# EasyEDA Pro project 原理图.epro

# Schematic 原理图
Board Name: Board1; Create Date: 2026-07-09; Page Name: P1; Project Name: H750VBT6_网球回收机器人; Schematic Name: 原理图; Update Date: 2026-07-12; Company: 嘉立创EDA; Page Size: A4; Version: V1.0
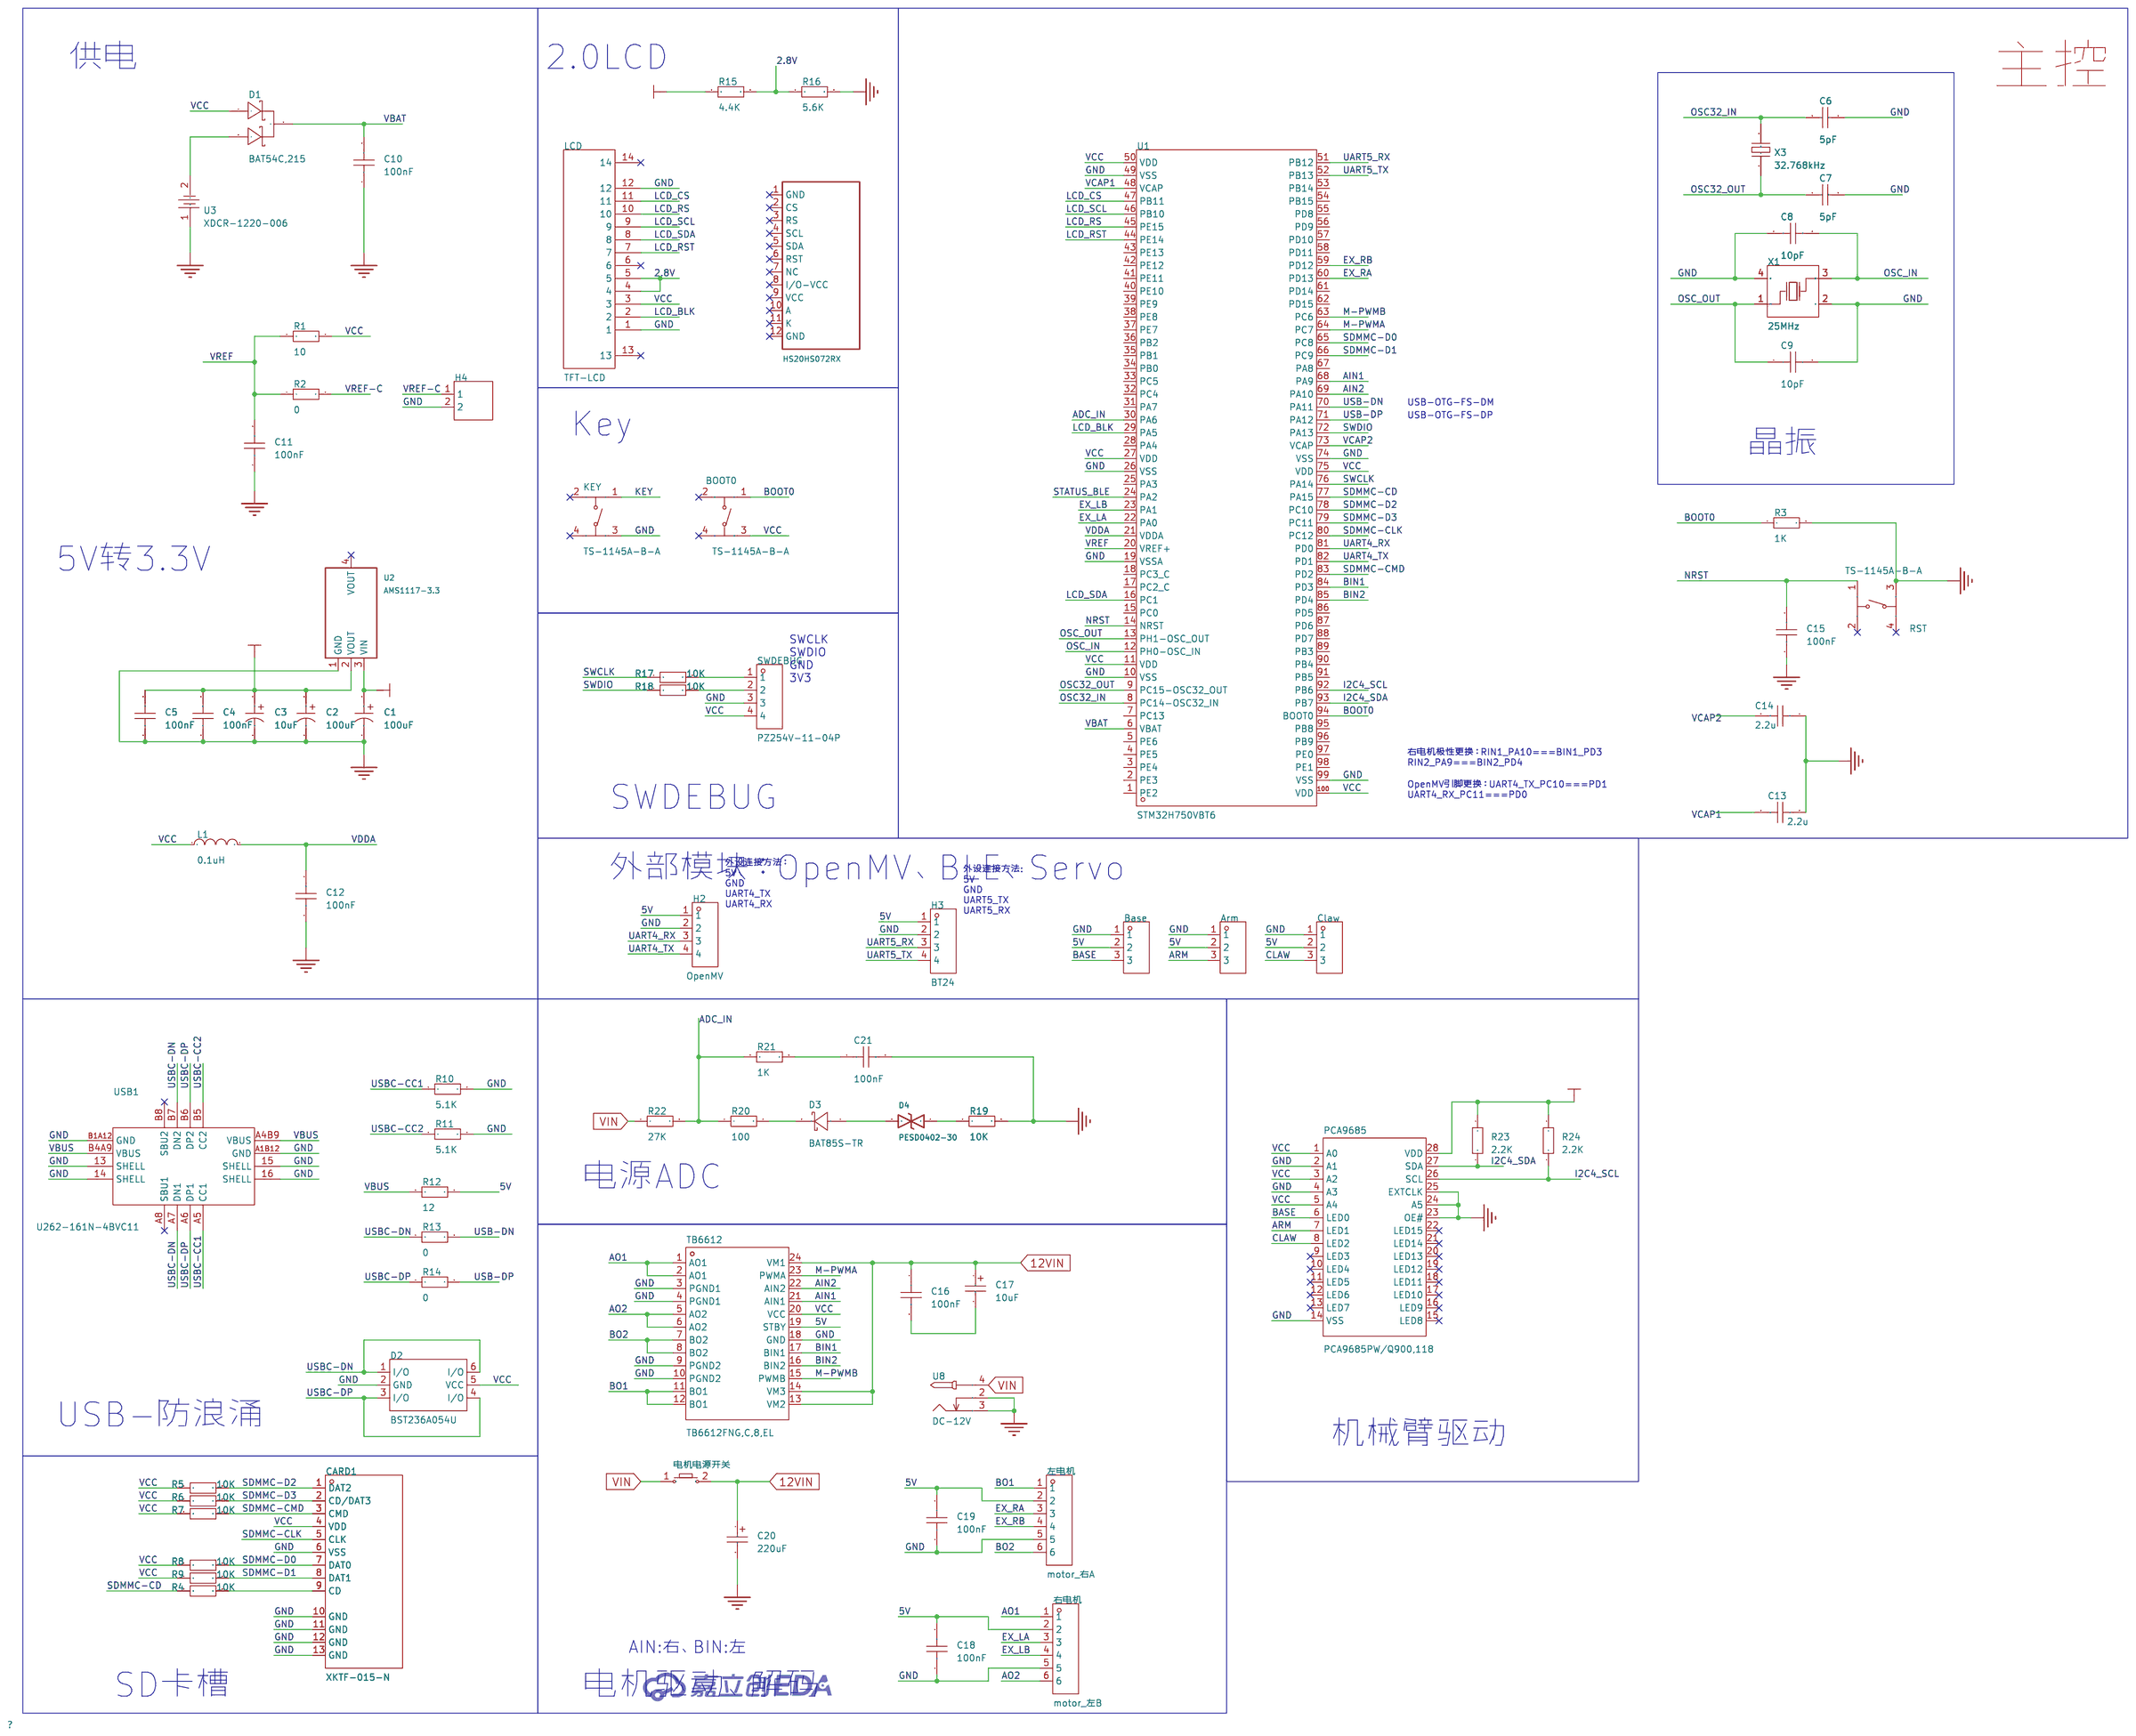
[diagram p0: schematic sheet]

## Parts
Arm  -  [HDR-TH_3P-P2.54-V-M]
Base  -  [HDR-TH_3P-P2.54-V-M]
BOOT0  TS-1145A-B-A  [SW-SMD_4P-L4.2-W3.2-P2.15-LS5.2]
C1  100uF  [CAP-SMD_L3.5-W2.8-FD]
C2  100uF  [CAP-SMD_L3.5-W2.8-FD]
C3  10uF  [CAP-SMD_L3.5-W2.8-FD]
C4  100nF  [C0603]
C5  100nF  [C0603]
C6  5pF  [C0402]
C7  5pF  [C0402]
C8  10pF  [C0402]
C9  10pF  [C0402]
C10  100nF  [C0402]
C11  100nF  [C0402]
C12  100nF  [C0402]
C13  2.2u  [C0402]
C14  2.2u  [C0402]
C15  100nF  [C0402]
C16  100nF  [C0402]
C17  10uF  [C_Ele_SMD_3x5.4mm]
C18  100nF  [C0402]
C19  100nF  [C0402]
C20  220uF  [C_Ele_SMD_3x5.4mm]
C21  100nF  [C0603]
CARD1  XKTF-015-N  [TF-SMD_XKTF-015-N]
Claw  -  [HDR-TH_3P-P2.54-V-M]
D1  BAT54C,215  [SOT-23-3_L2.9-W1.6-P1.90-LS2.8-BR]
D2  BST236A054U  [SOT-23-6_L2.9-W1.6-P0.95-LS2.8-BR]
D3  BAT85S-TR  [DO-35_BD1.7-L3.8-P7.8-D0.5-FD]
D4  PESD0402-30  [D0402-BI]
H2  OpenMV  [HDR-TH_4P-P2.54-V-M]
H3  BT24  [HDR-TH_4P-P2.54-V-M]
H4  -  [HDR-TH_2P-P2.54-V-M-1]
KEY  TS-1145A-B-A  [SW-SMD_4P-L4.2-W3.2-P2.15-LS5.2]
L1  0.1uH  [L0805]
LCD  TFT-LCD  [FPC-SMD_AFC01-S12FCA-00]
PCA9685  PCA9685PW/Q900,118  [TSSOP-28_L9.7-W4.4-P0.65-LS6.4-BL]
R1  10  [R0402]
R2  0  [R0402]
R3  1K  [R0402]
R4  10K  [R0402]
R5  10K  [R0402]
R6  10K  [R0402]
R7  10K  [R0402]
R8  10K  [R0402]
R9  10K  [R0402]
R10  5.1K  [R0402]
R11  5.1K  [R0402]
R12  12  [R0402]
R13  0  [R0402]
R14  0  [R0402]
R15  4.4K  [R0402]
R16  5.6K  [R0402]
R17  10K  [R0402]
R18  10K  [R0402]
R19  10K  [R0603]
R20  100  [R0603]
R21  1K  [R0603]
R22  27K  [R0603]
R23  2.2K  [R0603]
R24  2.2K  [R0603]
RST  TS-1145A-B-A  [SW-SMD_4P-L4.2-W3.2-P2.15-LS5.2]
SWDEBUG  PZ254V-11-04P  [HDR-TH_4P-P2.54-V-M]
TB6612  TB6612FNG,C,8,EL  [SSOP-24_L8.3-W5.6-P0.65-LS7.6-BL]
U1  STM32H750VBT6  [LQFP-100_L14.0-W14.0-P0.50-LS16.0-BL]
U2  AMS1117-3.3  [SOT-223-3_L6.5-W3.4-P2.30-LS7.0-BR]
U3  XDCR-1220-006  [BAT-SMD_CR1220-2ZX]
U7  HS20HS072RX  [OLED-SMD_HS20HS072RX]
U8  DC-12V  [DC-IN-TH_DC005-2.5MM]
USB1  U262-161N-4BVC11  [USB-3.1-SMD_U262-161N-4BVC11]
X1  25MHz  [CRYSTAL-SMD_4P-L3.2-W2.5-BL]
X3  32.768kHz  [CRYSTAL-SMD_L3.2-W1.5-1]
右电机  motor_左B  [CONN-TH_6P-P2.50_ZX-XH2.54-6PZZ]
左电机  motor_右A  [CONN-TH_6P-P2.50_ZX-XH2.54-6PZZ]
电机电源开关  -  [Key_SMD_3x4x2]

## Library data of the parts
Arm Base Claw = HDR-M_2.54_1x3P: Supplier Part: C2937625; Supplier Footprint: 插件
BOOT0 KEY RST = TS-1145A-B-A: 电路结构:单刀单掷;按钮形状:椭圆形按钮;作用力:160gf;安装方式:立贴;开关长度:4.2mm;开关宽度:3.2mm;开关高度:2.5mm;带支架:不带;触点电流:50mA;额定电压(DC):12V;绝缘电阻:-;带灯:无;机械寿命:10万次;; LCSC Part Name: 4.2*3.2*2.5mm 立贴 轻触开关; Supplier Part: C318904; Manufacturer: XKB Connectivity(中国星坤); Supplier Footprint: SMD; JLCPCB Part Class: 扩展库; Datasheet: https://atta.szlcsc.com/upload/public/pdf/source/20211011/FC00869C3CE33BCCD344D072F551E76B.pdf; Supplier: LCSC; Circuit: 单刀单掷; Actuator Style: 椭圆形按钮; Operating Force: 160gf; Mounting Style: 立贴; Switch Length: 4.2mm; Switch Width: 3.2mm; Switch Height: 2.5mm; Strike Gundam: 不带; Contact Current: 50mA; Voltage Rating (DC): 12V; Actuator/Cap Color: 白色; With Lamp: 无; Mechanical Life: 10万次; Operating Temperature: -30℃~+85℃
C1-C3 = CA45-B-10V-10UF-K: 容值:10uF;精度:±10%;额定电压:10V;等效串联电阻:-;; LCSC Part Name: 10uF ±10% 10V; Supplier Part: C2841149; Manufacturer: CEC(振华新云); Supplier Footprint: CASE-B-3528; JLCPCB Part Class: 扩展库; Datasheet: https://atta.szlcsc.com/upload/public/pdf/source/20210624/C2841149_442041CAD7FE484F90FD4ADE9C9027DE.pdf; Supplier: LCSC; Tolerance: ±10%; Rated Voltage: 10V
C4 C5 C21 = CAP_0603: Supplier Footprint: 0603
C6 C7 = 0402CG5R0C500NT: 容值:5pF;额定电压:50V;温度系数:C0G;; LCSC Part Name: ±0.25pF 5pF 50V; Supplier Part: C1573; Manufacturer: FH(风华); Supplier Footprint: 0402; JLCPCB Part Class: 扩展库; Datasheet: https://item.szlcsc.com/datasheet/0402CG5R0C500NT/1925.html; Supplier: LCSC; Voltage Rating: 50V; Temperature Coefficient: C0G
C8 C9 = CL05C100JB5NNNC: 容值:10pF;精度:±5%;额定电压:50V;温度系数:C0G;; LCSC Part Name: 10pF ±5% 50V; Supplier Part: C32949; Manufacturer: SAMSUNG(三星); Supplier Footprint: 0402; JLCPCB Part Class: 基础库; Datasheet: https://item.szlcsc.com/datasheet/CL05C100JB5NNNC/33914.html; Supplier: LCSC; Tolerance: ±5%; Voltage Rating: 50V; Temperature Coefficient: C0G
C10-C16 C18 C19 = CAP_0402: Supplier Footprint: 0402
C17 C20 = C_Ele_SMD_3x5.4mm: Supplier Footprint: SMD,3x5.4mm
CARD1 = XKTF-015-N: 卡连接方式:自弹式;卡类型:MicroSD卡(TF卡);连接器类型:卡座;本体最大高度:2mm;工作温度:-25℃~+90℃;; LCSC Part Name: 自弹式 MicroSD卡(TF卡) 卡座; Supplier Part: C381082; Manufacturer: XKB Connection(中国星坤); Supplier Footprint: SMD; JLCPCB Part Class: 扩展库; Datasheet: https://item.szlcsc.com/datasheet/XKTF-015-N/353314.html; Supplier: LCSC; Card Connection Mode: 自弹式; Card Type: MicroSD卡(TF卡); Connector Type: 卡座; Height Above Board: 2mm; Operating Temperature: -25℃~+90℃
D1 = BAT54C,215: 二极管配置:1对共阴极;正向压降(Vf):800mV@100mA;直流反向耐压(Vr):30V;整流电流:200mA;; LCSC Part Name: 电压:30V 电流:200mA; Supplier Part: C37704; Manufacturer: Nexperia(安世); Supplier Footprint: SOT-23; JLCPCB Part Class: 扩展库; Datasheet: https://item.szlcsc.com/datasheet/BAT54C%252C215/38684.html; Supplier: LCSC; Diode Configuration: 1对共阴极; Voltage - Forward(Vf@If): 800mV@100mA; Voltage - DC Reverse(Vr): 30V; Current - Rectified: 200mA; Reverse Leakage Current (Ir): 2uA@25V; Non-Repetitive Peak Forward Surge Current: 600mA
D2 = BST236A054U: 极性:-;反向截止电压(Vrwm):5V;钳位电压:13V;峰值脉冲电流(Ipp):3.5A;峰值脉冲功率(Ppp):45W@8/20us;击穿电压:6V;; LCSC Part Name: ESD 5V截止 峰值浪涌电流：3.5A; Supplier Part: C406203; Manufacturer: BORN(伯恩半导体); Supplier Footprint: SOT-23-6; JLCPCB Part Class: 扩展库; Datasheet: https://item.szlcsc.com/datasheet/BST236A054U/393966.html; Supplier: LCSC; Reverse Stand-Off Voltage (Vrwm): 5V; Clamping Voltage: 13V; Peak Pulse Current (Ipp): 3.5A; Peak Pulse Power Dissipation (Ppp): 45W@8/20us; Voltage - Breakdown: 6V; Reverse Leakage Current (Ir): 500nA; Number of Channels: 四路; level of protection: IEC 61000-4-4；IEC 61000-4-5；IEC 61000-4-2; Type: ESD; Junction Capacitance: 0.2pF；0.36pF
D3 = BAT85S-TR: 二极管配置:1个独立式;正向压降(Vf):800mV@100mA;直流反向耐压(Vr):30V;整流电流:200mA;; Supplier Part: C5334431; Manufacturer: VISHAY(威世); Supplier Footprint: DO-35; JLCPCB Part Class: 扩展库; Datasheet: https://item.szlcsc.com/datasheet/BAT85S-TR/6098608.html; Supplier: LCSC; Diode Configuration: 1个独立式; Voltage - Forward(Vf@If): 800mV@100mA; Voltage - DC Reverse(Vr): 30V; Current - Rectified: 200mA; Reverse Leakage Current (Ir): 2uA@25V; Non-Repetitive Peak Forward Surge Current: 5A
D4 = PESD0402-30: 极性:双向;反向截止电压(Vrwm):30V;钳位电压:40V;; Supplier Part: C55111460; Manufacturer: R+O(宏嘉诚); Supplier Footprint: 0402; JLCPCB Part Class: 扩展库; Datasheet: https://item.szlcsc.com/datasheet/PESD0402-30/58798226.html; Supplier: LCSC; Polarity: 双向; Reverse Stand-Off Voltage (Vrwm): 30V; Clamping Voltage: 40V; Reverse Leakage Current (Ir): 10nA; Number of Channels: 单路; Operating Temperature: -55℃~+125℃; level of protection: IEC 61000-4-2; Type: ESD; Junction Capacitance: 0.05pF
H2 H3 SWDEBUG = PZ254V-11-04P: 插针结构:1x4P;间距:2.54mm;行距:-;圆针/方针:方针;安装方式:直插;排数:单排;总PIN位数:4P;额定电流:3A;额定电压:250V;配合针长度:6mm;塑高:2.5mm;端接针长度:3mm;触头材质:-;工作温度:-40℃~+105℃;颜色:黑色;; LCSC Part Name: 1x4P 间距:2.54mm 方针 直插; Supplier Part: C2691448; Manufacturer: XFCN(兴飞); Supplier Footprint: 插件,P=2.54mm; JLCPCB Part Class: 扩展库; Datasheet: https://item.szlcsc.com/datasheet/PZ254V-11-04P/2801085.html; Supplier: LCSC; Pin Structure: 1x4P; Pitch: 2.54mm; Circluar Pins/Square Pins: 方针; Mounting Type: 直插; Number of Rows: 单排; Number of Pins: 4P; Current Rating: 3A; Voltage Rating (Max): 250V; Length of Mating Pin: 6mm; Insulation Height: 2.5mm; Length of End Connection Pin: 3mm; Operating Temperature: -40℃~+105℃; Color: 黑色
H4 = HDR-M_2.54_1x2P: Supplier Part: C124375; Supplier Footprint: 插件
L1 = L_0805
LCD = AFC01-S12FCA-00: 锁定特性:翻盖式;触点类型:下接;触点数量:12P;间距:0.5mm;安装方式:卧贴;; LCSC Part Name: 间距:0.5mm P数:12P 翻盖式 下接; Supplier Part: C262661; Manufacturer: JS(钜硕电子); Supplier Footprint: SMD,P=0.5mm,卧贴; JLCPCB Part Class: 扩展库; Datasheet: https://item.szlcsc.com/datasheet/AFC01-S12FCA-00/253920.html; Supplier: LCSC; Locking Feature: 翻盖式; Contact Type: 下接; Number of Contacts: 12P; Pitch: 0.5mm; Mounting Type: 卧贴; FFC, FCB Thickness: 0.3mm; Height Above Board: 2mm
PCA9685 = PCA9685PW/Q900,118: 类型:-;工作电压(DC):2.3V~5.5V;通道数:16;输出电压:5.5V;输出电流:25mA;调光:PWM;; Supplier Part: C92206; Manufacturer: NXP(恩智浦); Supplier Footprint: TSSOP-28; JLCPCB Part Class: 扩展库; Datasheet: https://www.nxp.com.cn/docs/en/data-sheet/PCA9685.pdf; Supplier: LCSC; Voltage - Input(DC): 2.3V~5.5V; Number of Channels: 16; Output Voltage: 5.5V; Output Current: 25mA; Dimming: PWM; Operating temperature: -40℃~+85℃
R1-R18 = Res_0402: Supplier Footprint: 0402
R19-R24 = Res_0603: Supplier Footprint: 0603
TB6612 = TB6612FNG,C,8,EL: TB6612FNG 是一款直流电机驱动 IC，其输出晶体管采用低导通电阻的 LD MOS 结构。两个输入信号 IN1 和 IN2 可选择四种模式之一，如正转、反转、短路制动和停止模式。; LCSC Part Name: 1A 有刷直流电机驱动芯片 5.5V; Supplier Part: C141517; Manufacturer: TOSHIBA(东芝); Supplier Footprint: SSOP-24; JLCPCB Part Class: 扩展库; Datasheet: https://item.szlcsc.com/datasheet/TB6612FNG%252CC%252C8%252CEL/152848.html; Supplier: LCSC; Technology: 是; Number of H-bridges: 2; Output Current: 1A; Peak Current: 3.2A; Voltage - Supply: 2.7V~5.5V; RDS(on): 500mΩ; Quiescent Current(Iq): 1uA; Operating Temperature: -20℃~+85℃
U1 = STM32H750VBT6: CPU内核:ARM-M系列;CPU最大主频:480MHz;应用领域:-;; LCSC Part Name: 带DSP和DP-FPU的高性能ARM Cortex-M7 MCU，具有128 KB Flash、1 MB RAM、480 MHz CPU、一级缓存、外部存储器接口、JPEG编解码器、硬件加密和大量外设; Supplier Part: C404010; Manufacturer: ST(意法半导体); Supplier Footprint: LQFP-100(14x14); JLCPCB Part Class: 扩展库; Datasheet: https://item.szlcsc.com/datasheet/STM32H750VBT6/391001.html; Supplier: LCSC; CPU Core: ARM-M系列; CPU Maximum Speed: 480MHz; Program Storage Size: 128KB; Program Memory Type: FLASH; Number of I/O: 82; ADC (Bit): 16bit; DAC (Bit): 12bit; Voltage - Supply: 1.62V~3.6V
U2 = AMS1117-3.3_C6186: 输出极性:正极;工作电压:15V;输出电压:3.3V;输出电流:1A;电源纹波抑制比(PSRR):72dB@(120Hz);输出类型:固定;; LCSC Part Name: 3.3V 1A 15V; Supplier Part: C6186; Manufacturer: Advanced Monolithic Systems; Supplier Footprint: SOT-223; JLCPCB Part Class: 基础库; Datasheet: https://item.szlcsc.com/datasheet/AMS1117-3.3/6652.html; Supplier: LCSC; Output Configuration: 正极; Voltage - Supply: 15V; Output Voltage: 3.3V; Output Current: 1A; Power Supply Rejection Ratio (PSRR): 72dB@(120Hz); Voltage Dropout: 1.1V@(800mA); standby current: 5mA; Noise: 0.003%Vout; Features: 短路保护；热关断；过流保护; Operating Temperature: -40℃~+125℃; Output Type: 固定; Number of Outputs: 1
U3 = XDCR-1220-006: 连接器类型:电池底座;适用电池规格:CR1220;触头材质:-;触头镀层:金;工作温度:-40℃~+85℃;; LCSC Part Name: 电池底座 适用电池:CR1220; Supplier Part: C7498147; Manufacturer: LX(连欣科技); Supplier Footprint: SMD; JLCPCB Part Class: 扩展库; Datasheet: https://item.szlcsc.com/datasheet/XDCR-1220-006/8568589.html; Supplier: LCSC; Connector Type: 电池底座; Battery Type: CR1220; Contact Plating: 金; Operating Temperature: -40℃~+85℃
U7 = HS20HS072RX: 核心芯片:ST7789;接口类型:SPI;尺寸(inch):2;像素分辨率:320x240;; LCSC Part Name: 2.0寸240*320(RGB)彩色SPI串口TFT液晶显示屏; Supplier Part: C5329582; Manufacturer: HS(汉昇); JLCPCB Part Class: 扩展库; Datasheet: https://item.szlcsc.com/datasheet/HS20HS072RX/6087843.html; Supplier: LCSC; Controller Type: ST7789; Interface: SPI; Size: 2; Dot Pixels: 320x240; Operating Temperature: -20℃~+70℃; Display Range: 30.6x40.8mm; Viewing Direction: 全视角; Voltage - Supply: 2.4V~3.3V；1.65V~3.3V
U8 = DC005-2.5: 连接器类型:DC电源插座;安装方式:弯插;触点内径:2.5mm;触点外径:6.3mm;额定电流:500mA;额定电压:12V;工作温度:-30℃~+70℃;; LCSC Part Name: DC005-2.5黑(铁); Supplier Part: C7507454; Manufacturer: SHOU HAN(首韩); Supplier Footprint: 插件; JLCPCB Part Class: 扩展库; Datasheet: https://item.szlcsc.com/datasheet/DC005-2.5/8598476.html; Supplier: LCSC; Connector Type: DC电源插座; Mounting Type: 弯插; Inside Contact Diameter: 2.5mm; Outside Contact Diameter: 6.3mm; Current Rating: 500mA; Voltage Rating (Max): 12V; Operating Temperature: -30℃~+70℃
USB1 = U262-161N-4BVC11: 连接器类型:Type-C;协议标准:-;公母:母;安装方式:卧贴;触点数量:16P;端口数量:1;额定电流 - 电源:3A;工作温度:-40℃~+85℃;; LCSC Part Name: Type-C 母 卧贴; Supplier Part: C319148; Manufacturer: XKB Connection(中国星坤); Supplier Footprint: SMD; JLCPCB Part Class: 扩展库; Datasheet: https://item.szlcsc.com/datasheet/U262-161N-4BVC11/300240.html; Supplier: LCSC; Connector Type: Type-C; Gender: 母; Mounting Type: 卧贴; Number of Contacts: 16P; Number of Ports: 1; Current Rating-Power: 3A; Connect-Disconnect Life: 3千次; Length: 7.3mm; Operating Temperature: -40℃~+85℃
X1 = X322525MOB4SI: 晶振类型:贴片晶振;频率:25MHz;常温频差:±10ppm;负载电容:12pF;频率稳定度:±20ppm;; LCSC Part Name: YSX321SL 25MHZ 4P 3225 12PF ±10PPM -40~85℃ (±20PPM); Supplier Part: C9006; Manufacturer: YXC(扬兴晶振); Supplier Footprint: SMD3225-4P; JLCPCB Part Class: 基础库; Datasheet: https://item.szlcsc.com/datasheet/X322525MOB4SI/9526.html; Supplier: LCSC; Type: 贴片晶振; Normal temperature Frequency Tolerance: ±10ppm; Load Capacitance: 12pF; Frequency Stability: ±20ppm; Operating Temperature: -40℃~+85℃
X3 = FC-135R 32.7680KA-A3: 频率:32.768kHz;常温频差:±20ppm;负载电容:12.5pF;; LCSC Part Name: 32.768kHz ±20ppm 12.5pF; Supplier Part: C6554955; Manufacturer: EPSON(爱普生); Supplier Footprint: SMD3215-2P; JLCPCB Part Class: 扩展库; Datasheet: https://item.szlcsc.com/datasheet/FC-135R%252032.7680KA-A3/7508731.html; Supplier: LCSC; Normal temperature Frequency Tolerance: ±20ppm; Load Capacitance: 12.5pF; Equivalent Series Resistance(ESR): 50kΩ; Operating Temperature: -40℃~+85℃
右电机 左电机 = ZX-XH2.54-6PZZ: 插针结构:1x6P;间距:2.5mm;安装方式:直插;参考系列:XH;总PIN数:6P;排数:1;每排PIN数:6;行距:-;额定电流:3A;触头材质:黄铜;触头镀层:锡;工作温度:-25℃~+85℃;; LCSC Part Name: 1x6P 间距:2.5mm 直插 系列:XH; Supplier Part: C7429636; Manufacturer: Megastar(兆星); Supplier Footprint: 插件,P=2.5mm; JLCPCB Part Class: 扩展库; Datasheet: https://item.szlcsc.com/datasheet/ZX-XH2.54-6PZZ/8427553.html; Supplier: LCSC; Pins Structure: 1x6P; Pitch: 2.5mm; Mounting Type: 直插; Reference Series: XH; Number of Pins: 6P; Number of Rows: 1; Number of PINs Per Row: 6; Current Rating: 3A; Contact Material: 黄铜; Contact Plating: 锡; Operating Temperature: -25℃~+85℃; Voltage Rating: 250V; Plastic Material: PA66; Flame Retardant Rating: UL94V-0; Color: 白色; Z-Height of the Board: 7mm; X-Length of Bottom Edge on Board (Spacing Line): 17.5mm; Y-Width of Bottom Edge on Board: 5.9mm
电机电源开关 = Key_SMD_3x4x2: Supplier Footprint: SMD

## Nets
2.8V: LCD.4 LCD.5 R15.2 R16.1
5V: Arm.2 Base.2 C1.1 C18.2 C19.2 Claw.2 H2.1 H3.1 R12.2 R15.1 TB6612.19(STBY) U2.3(VIN) 右电机.2 左电机.2
12VIN: C16.1 C17.1 C20.1 TB6612.13(VM2) TB6612.14(VM3) TB6612.24(VM1) 电机电源开关.2
GND: Arm.1 Base.1 C1.2 C2.2 C3.2 C4.1 C5.1 C6.2 C7.2 C8.1 C9.2 C10.1 C11.1 C12.1 C13.1 C14.1 C15.1 C18.1 C19.1 C20.2 C21.2 CARD1.6(VSS) CARD1.10(GND) CARD1.11(GND) CARD1.12(GND) CARD1.13(GND) Claw.1 D2.2(GND) H2.2 H3.2 H4.2 KEY.3 LCD.1 LCD.12 PCA9685.2(A1) PCA9685.4(A3) PCA9685.14(VSS) PCA9685.23(OE#) PCA9685.24(A5) PCA9685.25(EXTCLK) R3.2 R10.2 R11.2 R16.2 R19.2 RST.3 SWDEBUG.3 TB6612.3(PGND1) TB6612.4(PGND1) TB6612.9(PGND2) TB6612.10(PGND2) TB6612.18(GND) U1.10(VSS) U1.19(VSSA) U1.26(VSS) U1.49(VSS) U1.74(VSS) U1.99(VSS) U2.1(GND) U3.1 U8.2 U8.3 USB1.13(SHELL) USB1.14(SHELL) USB1.15(SHELL) USB1.16(SHELL) USB1.A1B12(GND) USB1.B1A12(GND) X1.2(GND) X1.4(GND) 右电机.5 左电机.5
VBAT: C10.2 D1.3(K) U1.6(VBAT)
VBUS: R12.1 USB1.A4B9(VBUS) USB1.B4A9(VBUS)
VCC: BOOT0.3 C2.1 C3.1 C4.2 C5.2 CARD1.4(VDD) D1.1(A) D2.5(VCC) L1.1 LCD.3 PCA9685.1(A0) PCA9685.3(A2) PCA9685.5(A4) PCA9685.28(VDD) R1.2 R5.1 R6.1 R7.1 R8.1 R9.1 R23.2 R24.2 SWDEBUG.4 TB6612.20(VCC) U1.11(VDD) U1.27(VDD) U1.50(VDD) U1.75(VDD) U1.100(VDD) U2.2(VOUT)
VDDA: C12.2 L1.2 U1.21(VDDA)
VIN: R22.1 U8.4 电机电源开关.1
ADC_IN: R20.1 R21.1 R22.2 U1.30(PA6)
AIN1: TB6612.21(AIN1) U1.68(PA9)
AIN2: TB6612.22(AIN2) U1.69(PA10)
AO1: TB6612.1(AO1) TB6612.2(AO1) 右电机.1
AO2: TB6612.5(AO2) TB6612.6(AO2) 右电机.6
ARM: Arm.3 PCA9685.7(LED1)
BASE: Base.3 PCA9685.6(LED0)
BIN1: TB6612.17(BIN1) U1.84(PD3)
BIN2: TB6612.16(BIN2) U1.85(PD4)
BO1: TB6612.11(BO1) TB6612.12(BO1) 左电机.1
BO2: TB6612.7(BO2) TB6612.8(BO2) 左电机.6
BOOT0: BOOT0.1 R3.1 U1.94(BOOT0)
CLAW: Claw.3 PCA9685.8(LED2)
EX_LA: U1.22(PA0) 右电机.3
EX_LB: U1.23(PA1) 右电机.4
EX_RA: U1.60(PD13) 左电机.3
EX_RB: U1.59(PD12) 左电机.4
I2C4_SCL: PCA9685.26(SCL) R24.1 U1.92(PB6)
I2C4_SDA: PCA9685.27(SDA) R23.1 U1.93(PB7)
KEY: KEY.1
LCD_BLK: LCD.2 U1.29(PA5)
LCD_CS: LCD.11 U1.47(PB11)
LCD_RS: LCD.10 U1.45(PE15)
LCD_RST: LCD.7 U1.44(PE14)
LCD_SCL: LCD.9 U1.46(PB10)
LCD_SDA: LCD.8 U1.16(PC1)
M-PWMA: TB6612.23(PWMA) U1.64(PC7)
M-PWMB: TB6612.15(PWMB) U1.63(PC6)
NRST: C15.2 RST.1 U1.14(NRST)
OSC32_IN: C6.1 U1.8(PC14-OSC32_IN) X3.2(GND)
OSC32_OUT: C7.1 U1.9(PC15-OSC32_OUT) X3.1
OSC_IN: C8.2 U1.12(PH0-OSC_IN) X1.3(OSC2)
OSC_OUT: C9.1 U1.13(PH1-OSC_OUT) X1.1(OSC1)
SDMMC-CD: R4.1 U1.77(PA15)
SDMMC-CLK: CARD1.5(CLK) U1.80(PC12)
SDMMC-CMD: CARD1.3(CMD) R7.2 U1.83(PD2)
SDMMC-D0: CARD1.7(DAT0) R8.2 U1.65(PC8)
SDMMC-D1: CARD1.8(DAT1) R9.2 U1.66(PC9)
SDMMC-D2: CARD1.1(DAT2) R5.2 U1.78(PC10)
SDMMC-D3: CARD1.2(CD/DAT3) R6.2 U1.79(PC11)
STATUS_BLE: U1.24(PA2)
SWCLK: R17.1 U1.76(PA14)
SWDIO: R18.1 U1.72(PA13)
UART4_RX: H2.3 U1.81(PD0)
UART4_TX: H2.4 U1.82(PD1)
UART5_RX: H3.3 U1.51(PB12)
UART5_TX: H3.4 U1.52(PB13)
USB-DN: R13.2 U1.70(PA11)
USB-DP: R14.2 U1.71(PA12)
USBC-CC1: R10.1 USB1.A5(CC1)
USBC-CC2: R11.1 USB1.B5(CC2)
USBC-DN: D2.1(I/O) D2.6(I/O) R13.1 USB1.A7(DN1) USB1.B7(DN2)
USBC-DP: D2.3(I/O) D2.4(I/O) R14.1 USB1.A6(DP1) USB1.B6(DP2)
VCAP1: C13.2 U1.48(VCAP)
VCAP2: C14.2 U1.73(VCAP)
VREF: C11.2 R1.1 R2.1 U1.20(VREF+)
VREF-C: H4.1 R2.2
Net-(C16-2): C16.2 C17.2
Net-(C21-1): C21.1 R21.2
Net-(CARD1-9): CARD1.9(CD) R4.2
Net-(D1-2): D1.2(A) U3.2
Net-(D3-1): D3.1(A) D4.2
Net-(D3-2): D3.2(K) R20.2
Net-(D4-1): D4.1 R19.1
Net-(R17-2): R17.2 SWDEBUG.1
Net-(R18-2): R18.2 SWDEBUG.2

Not connected (* = marked no-connect by the designer): BOOT0 2* 4*; KEY 2* 4*; LCD 6* 13* 14*; PCA9685 9(LED3)* 10(LED4)* 11(LED5)* 12(LED6)* 13(LED7)* 15(LED8)* 16(LED9)* 17(LED10)* 18(LED11)* 19(LED12)* 20(LED13)* 21(LED14)* 22(LED15)*; RST 2* 4*; U1 1(PE2) 2(PE3) 3(PE4) 4(PE5) 5(PE6) 7(PC13) 15(PC0) 17(PC2_C) 18(PC3_C) 25(PA3) 28(PA4) 31(PA7) 32(PC4) 33(PC5) 34(PB0) 35(PB1) 36(PB2) 37(PE7) 38(PE8) 39(PE9) 40(PE10) 41(PE11) 42(PE12) 43(PE13) 53(PB14) 54(PB15) 55(PD8) 56(PD9) 57(PD10) 58(PD11) 61(PD14) 62(PD15) 67(PA8) 86(PD5) 87(PD6) 88(PD7) 89(PB3) 90(PB4) 91(PB5) 95(PB8) 96(PB9) 97(PE0) 98(PE1); U2 4(VOUT)*; U7 1(GND)* 2(CS)* 3(RS)* 4(SCL)* 5(SDA)* 6(RST)* 7(NC)* 8(I/O-VCC)* 9(VCC)* 10(A)* 11(K)* 12(GND)*; USB1 A8(SBU1)* B8(SBU2)*

## Notes on the sheet
- 供电
- 2.0LCD
- 主控
- USB-OTG-FS-DM
- USB-OTG-FS-DP
- Key
- 晶振
- 5V转3.3V
- SWCLK
  SWDIO
  GND
  3V3
- 右电机极性更换：RIN1_PA10===BIN1_PD3
  RIN2_PA9===BIN2_PD4
- OpenMV引脚更换：UART4_TX_PC10===PD1
  UART4_RX_PC11===PD0
- SWDEBUG
- 外部模块：OpenMV、BLE、Servo
- 外设连接方法：
  5V
  GND
  UART4_TX
  UART4_RX
- 外设连接方法:
  5V
  GND
  UART5_TX
  UART5_RX
- 电源ADC
- USB-防浪涌
- 机械臂驱动
- AIN:右、BIN:左
- SD卡槽
- 电机驱动、解码
